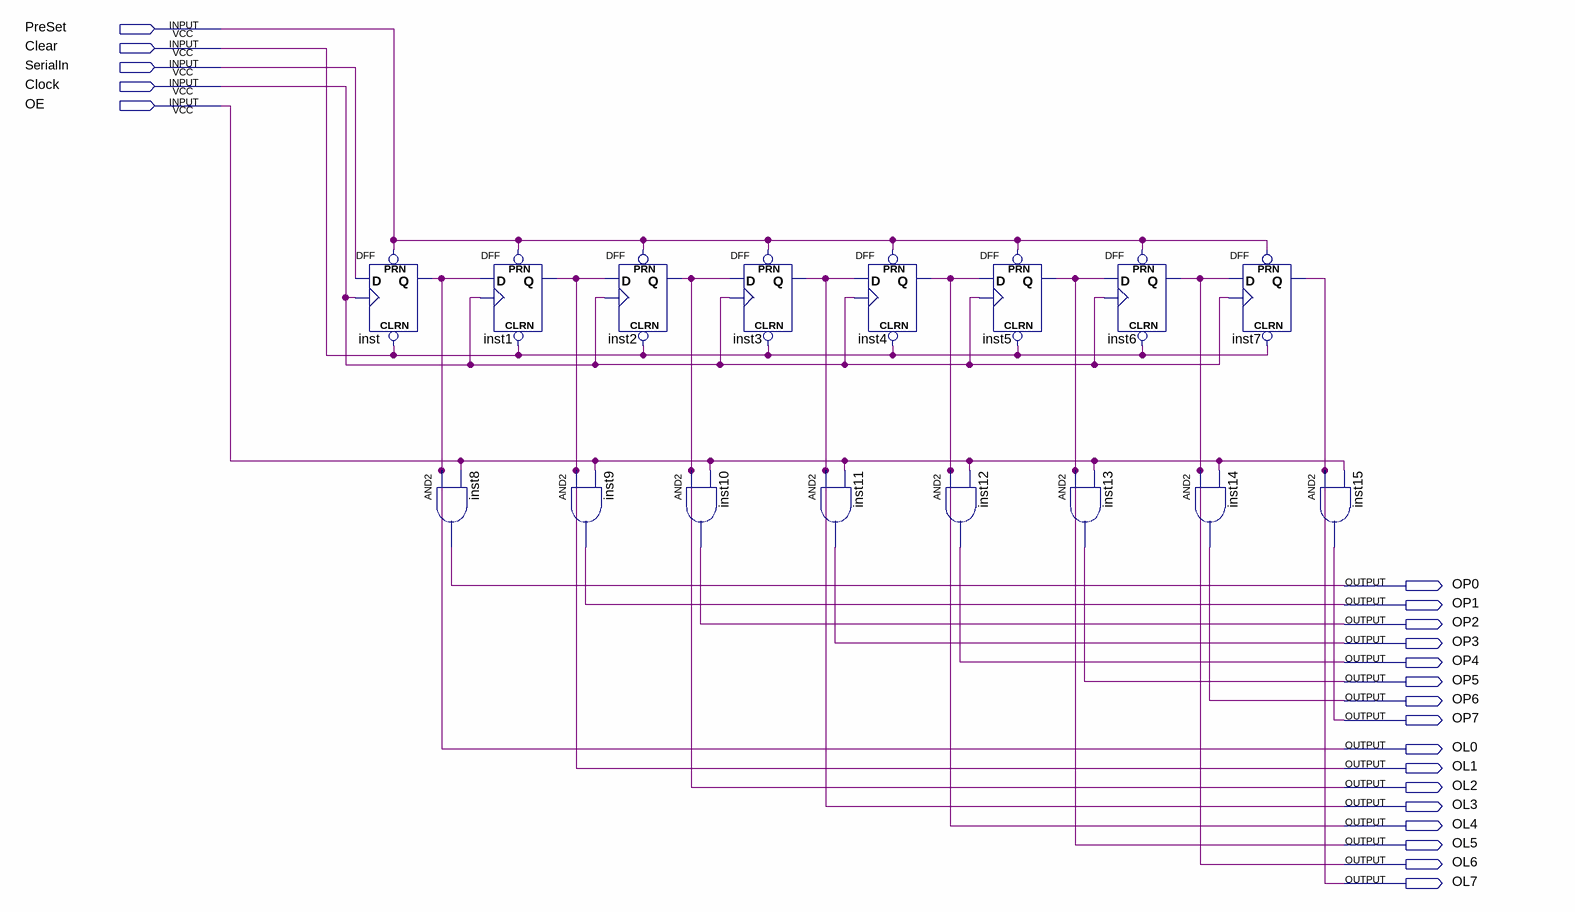
[diagram p0: schematic sheet]
// Quartus schematic SIPO8.bdf as structural Verilog: 16 symbols, 21 pins
module SIPO8 (
  input  PreSet,
  input  Clear,
  input  SerialIn,
  input  Clock,
  input  OE,
  output OP0,
  output OP1,
  output OP2,
  output OP3,
  output OP4,
  output OP5,
  output OP6,
  output OP7,
  output OL0,
  output OL1,
  output OL2,
  output OL3,
  output OL4,
  output OL5,
  output OL6,
  output OL7
);

  DFF inst (.CLRN(Clear), .CLK(Clock), .D(SerialIn), .PRN(PreSet), .Q(OL0));
  and inst8 (OP0, OL0, OE);
  DFF inst1 (.CLRN(Clear), .CLK(Clock), .D(OL0), .PRN(PreSet), .Q(OL1));
  and inst9 (OP1, OL1, OE);
  DFF inst2 (.CLRN(Clear), .CLK(Clock), .D(OL1), .PRN(PreSet), .Q(OL2));
  DFF inst3 (.CLRN(Clear), .CLK(Clock), .D(OL2), .PRN(PreSet), .Q(OL3));
  and inst10 (OP2, OL2, OE);
  and inst11 (OP3, OL3, OE);
  DFF inst4 (.CLRN(Clear), .CLK(Clock), .D(OL3), .PRN(PreSet), .Q(OL4));
  and inst12 (OP4, OL4, OE);
  DFF inst5 (.CLRN(Clear), .CLK(Clock), .D(OL4), .PRN(PreSet), .Q(OL5));
  DFF inst6 (.CLRN(Clear), .CLK(Clock), .D(OL5), .PRN(PreSet), .Q(OL6));
  and inst13 (OP5, OL5, OE);
  and inst14 (OP6, OL6, OE);
  DFF inst7 (.CLRN(Clear), .CLK(Clock), .D(OL6), .PRN(PreSet), .Q(OL7));
  and inst15 (OP7, OL7, OE);
endmodule
